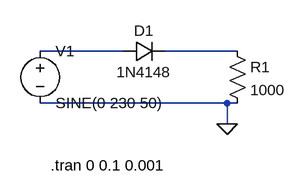
[diagram p0: schematic Half_Wave.asc]
Half_Wave.asc, the LTspice schematic file:
Version 4
SHEET 1 880 680
WIRE 128 96 0 96
WIRE 304 96 192 96
WIRE 288 176 0 176
WIRE 304 176 288 176
WIRE 288 208 288 176
FLAG 288 208 0
SYMBOL diode 128 112 R270
WINDOW 0 32 32 VTop 2
WINDOW 3 0 32 VBottom 2
SYMATTR InstName D1
SYMATTR Value 1N4148
SYMBOL res 288 80 R0
SYMATTR InstName R1
SYMATTR Value 1000
SYMBOL voltage 0 80 R0
WINDOW 123 0 0 Left 0
WINDOW 39 0 0 Left 0
SYMATTR InstName V1
SYMATTR Value SINE(0 230 50)
TEXT 16 272 Left 2 !.tran 0 0.1 0.001

The netlist it stands for:
* Half_Wave.asc
D1 N001 N002 1N4148
R1 N002 0 1000
V1 N001 0 SINE(0 230 50)
.model D D
.lib standard.dio
.tran 0 0.1 0.001
.backanno
.end